# Altium project motor_driver.PrjPCB
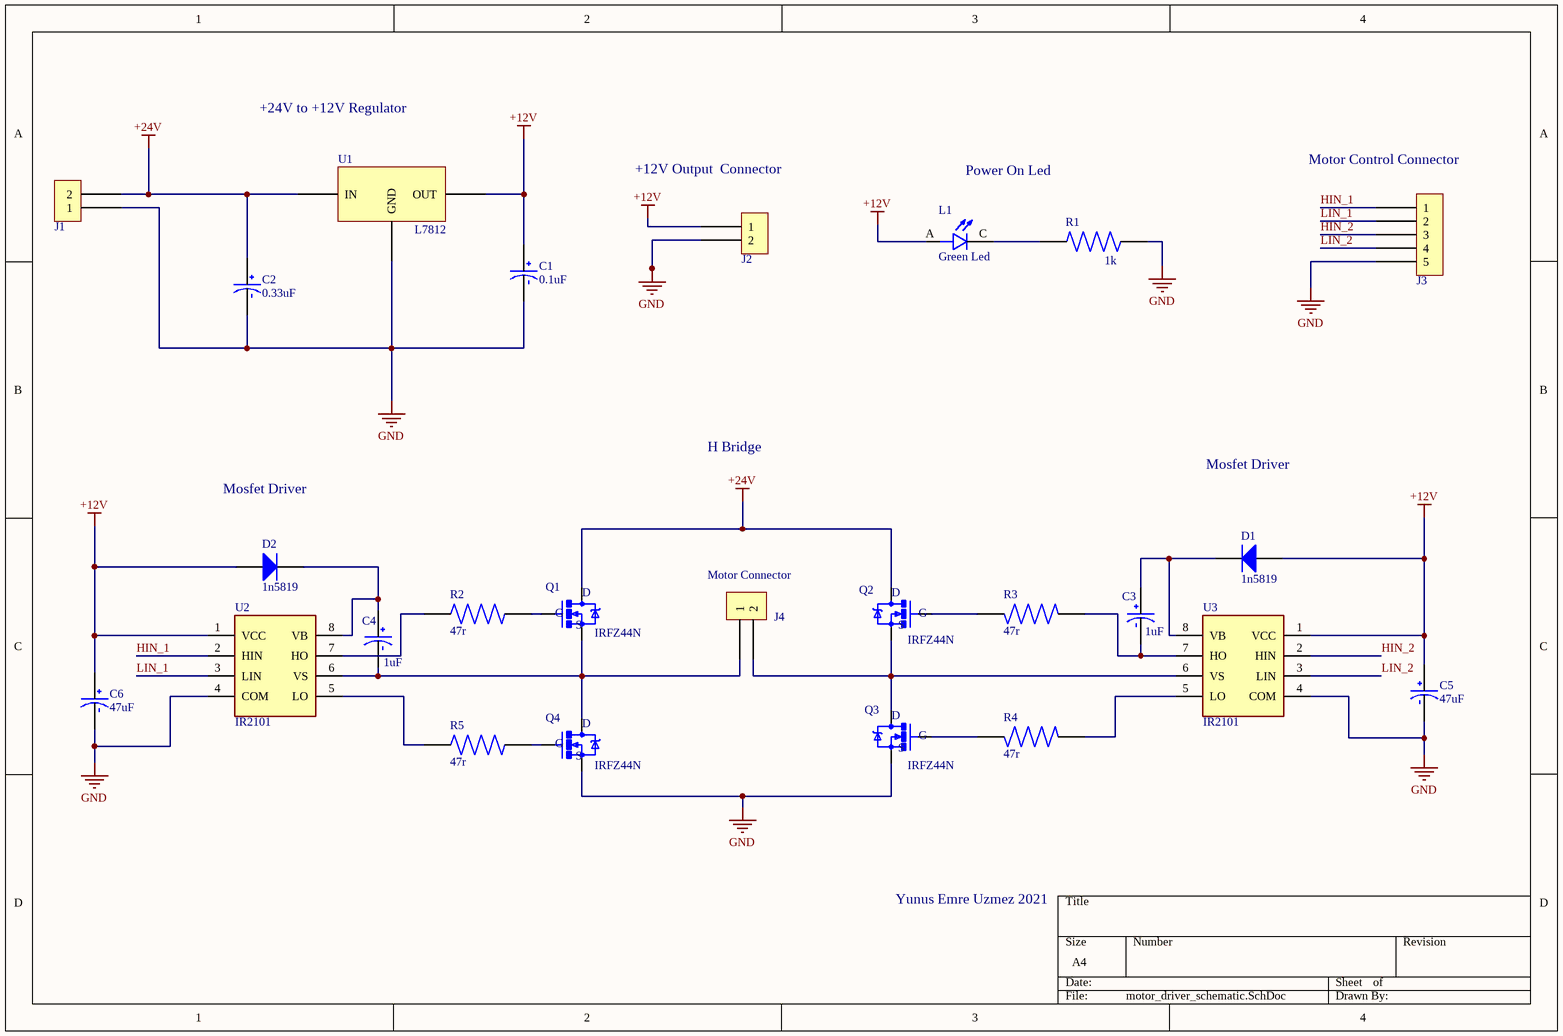
[diagram p0: motor_driver_schematic.SchDoc]
1 sheet, 25 parts. Net scope: global (net labels, ports and power ports of the same name join across sheets).
Board file: motor_driver_pcb.PcbDoc

## Sheet motor_driver_schematic.SchDoc
size A4

### Parts
C1  value 0.1uF  [Radial Capacitor]  (hidden comment: Cap 0.1uF)
C2  value 0.33uF  [Radial Capacitor]  (hidden comment: Cap 0.33uF)
C3  value 1uF  [Radial Capacitor]  (hidden comment: Cap 1uF)
C4  value 1uF  [Radial Capacitor]  (hidden comment: Cap 1uF)
C5  value 47uF  [Radial Capacitor]  (hidden comment: Cap 1uF)
C6  value 47uF  [Radial Capacitor]  (hidden comment: Cap 1uF)
D1  1N5819  [1n5819]
D2  1N5819  [1n5819]
J1  Terminal Block 1x2  [TERMINAL BLOCK 1X2 3.5MM]  (value not drawn)
J2  Terminal Block 1x2  [TERMINAL BLOCK 1X2 3.5MM]  (value not drawn)
J3  Header 1x5  [HEADER 1X5 3.5MM]  (value not drawn)
J4  Terminal Block 1x2  [TERMINAL BLOCK 1X2 3.5MM]  (value not drawn)
L1  Name: Green Led  [LED 5MM]  (hidden comment: Led Green)
Q1  IRFZ44N  [TO-220]
Q2  IRFZ44N  [TO-220]
Q3  IRFZ44N  [TO-220]
Q4  IRFZ44N  [TO-220]
R1  value 1k  [RESISTOR THT]  (hidden comment: Res 1k)
R2  value 47r  [RESISTOR THT]  (hidden comment: Res 47r)
R3  value 47r  [RESISTOR THT]  (hidden comment: Res 47r)
R4  value 47r  [RESISTOR THT]  (hidden comment: Res 47r)
R5  value 47r  [RESISTOR THT]  (hidden comment: Res 47r)
U1  L7812  [TO-220]
U2  IR2101  [PDIP-8]
U3  IR2101  [PDIP-8]

### Nets
+12V: C1.POS C5.POS C6.POS D1.1(A) D2.1(A) J2.1 L1.A U1.3(OUT) U2.1(VCC) U3.1(VCC)
+24V: C2.POS J1.2 Q1.2(D) Q2.2(D) U1.1(IN)
GND: C1.NEG C2.NEG C5.NEG C6.NEG J1.1 J2.2 J3.5 Q3.3(S) Q4.3(S) R1.2 U1.2(GND) U2.4(COM) U3.4(COM)
HIN_1: J3.1 U2.2(HIN)
HIN_2: J3.3 U3.2(HIN)
LIN_1: J3.2 U2.3(LIN)
LIN_2: J3.4 U3.3(LIN)
NetC3_NEG: C3.NEG R3.1 U3.7(HO)
NetC3_POS: C3.POS D1.2(K) U3.8(VB)
NetC4_NEG: C4.NEG J4.1 Q1.3(S) Q4.2(D) U2.6(VS)
NetC4_POS: C4.POS D2.2(K) U2.8(VB)
NetJ4_2: J4.2 Q2.3(S) Q3.2(D) U3.6(VS)
NetL1_C: L1.C R1.1
NetQ1_1: Q1.1(G) R2.2
NetQ2_1: Q2.1(G) R3.2
NetQ3_1: Q3.1(G) R4.2
NetQ4_1: Q4.1(G) R5.2
NetR2_1: R2.1 U2.7(HO)
NetR4_1: R4.1 U3.5(LO)
NetR5_1: R5.1 U2.5(LO)

### Notes on the sheet
- +24V to +12V Regulator
- (near J2) +12V Output  Connector
- Power On Led
- (near J3) Motor Control Connector
- H Bridge
- Mosfet Driver
- (near J4) Motor Connector
- Yunus Emre Uzmez 2021

### Library data of the parts
C1 = Cap 0.1uF: Aluminium Electrolytic Capacitor Radial Leaded  0.1uF 50V
C2 = Cap 0.33uF: Aluminium Electrolytic Capacitor Radial Leaded  0.33uF 50V
C3-C6 = Cap 1uF: Aluminium Electrolytic Capacitor Radial Leaded  1uF 50V
D1 D2 = 1N5819: DIODE SCHOTTKY 1A 40V BULK; Name: 1n5819
J1 J2 J4 = Terminal Block 1x2: Fixed Terminal Block , screw type, 5.08 , horizontal, 2 poles, CUI Blue, slotted screw, PCB mount
J3 = Header 1x5: 5 Pin (1x5) 2.54mm Male Pin Header THT
L1 = Led Green: HQG 5mm Led Green - 400-500 mcd
Q1-Q4 = IRFZ44N: Designed for low voltage, high speed switching applications in / power supplies, converters and power motor controls, these / devices are particularly well suited for bridge circuits where / diode speed and commutating safe operating areas are critical / and offer additional safety margin against unexpected voltage / transients.; Name: IRFZ44N
R1 = Res 1k: Carbon Film Resistor Through Hole 1k
R2-R5 = Res 47r: Carbon Film Resistor Through Hole 47r
U1 = L7812: The L7800 series of three-terminal positive / regulators is available in TO-220 ISOWATT220 / TO-3 and D2PAK packages and several fixed / output voltages, making it useful in a wide range / of applications.These regulators can provide local / on-card regulation, eliminating the distribution / problems associated with single point regulation. / Each type employs internal current limiting, / thermal shut-down and safe area protection, / making it essentially indestructible. If adequate / heat sinking is provided, they can deliver over 1A / output current. Although designed primarily as / fixed voltage regulators, these devices can be / used with external components to obtain / adjustable voltages and currents.; Name: L7812
U2 U3 = IR2101: The IR2101(S)/IR2102(S) are high voltage, high speed / power MOSFET and IGBT drivers with independent / high and low side referenced output channels. Proprietary HVIC and latch immune CMOS technologies / enable ruggedized monolithic construction. The logic / input is compatible with standard CMOS or LSTTL / output, down to 3.3V logic. The output drivers feature a high pulse current buffer stage designed for minimum / driver cross-conduction. The floating channel can be used to drive an N-channel power MOSFET or IGBT in / the high side configuration which operates up to 600 volts.; Name: IR2101